# Altium schematic sheet PenAndPaper.SchDoc
size A
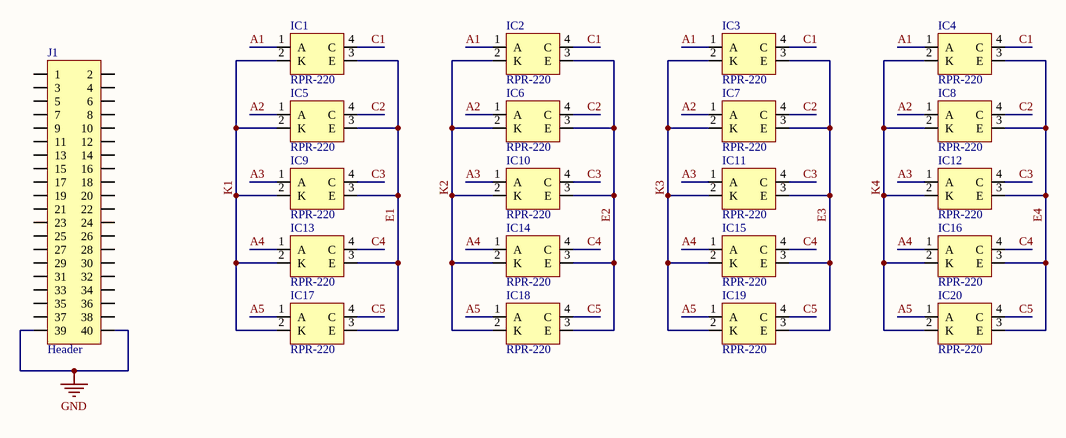
[diagram p0: PenAndPaper.SchDoc]

## Parts
IC1  RPR-220  [RPR_220]
IC2  RPR-220  [RPR_220]
IC3  RPR-220  [RPR_220]
IC4  RPR-220  [RPR_220]
IC5  RPR-220  [RPR_220]
IC6  RPR-220  [RPR_220]
IC7  RPR-220  [RPR_220]
IC8  RPR-220  [RPR_220]
IC9  RPR-220  [RPR_220]
IC10  RPR-220  [RPR_220]
IC11  RPR-220  [RPR_220]
IC12  RPR-220  [RPR_220]
IC13  RPR-220  [RPR_220]
IC14  RPR-220  [RPR_220]
IC15  RPR-220  [RPR_220]
IC16  RPR-220  [RPR_220]
IC17  RPR-220  [RPR_220]
IC18  RPR-220  [RPR_220]
IC19  RPR-220  [RPR_220]
IC20  RPR-220  [RPR_220]
J1  Header  [PINHD_2.54_2X40]

## Nets
GND: J1.39 J1.40
A1: IC1.1(A) IC2.1(A) IC3.1(A) IC4.1(A)
A2: IC5.1(A) IC6.1(A) IC7.1(A) IC8.1(A)
A3: IC9.1(A) IC10.1(A) IC11.1(A) IC12.1(A)
A4: IC13.1(A) IC14.1(A) IC15.1(A) IC16.1(A)
A5: IC17.1(A) IC18.1(A) IC19.1(A) IC20.1(A)
C1: IC1.4(C) IC2.4(C) IC3.4(C) IC4.4(C)
C2: IC5.4(C) IC6.4(C) IC7.4(C) IC8.4(C)
C3: IC9.4(C) IC10.4(C) IC11.4(C) IC12.4(C)
C4: IC13.4(C) IC14.4(C) IC15.4(C) IC16.4(C)
C5: IC17.4(C) IC18.4(C) IC19.4(C) IC20.4(C)
E1: IC1.3(E) IC5.3(E) IC9.3(E) IC13.3(E) IC17.3(E)
E2: IC2.3(E) IC6.3(E) IC10.3(E) IC14.3(E) IC18.3(E)
E3: IC3.3(E) IC7.3(E) IC11.3(E) IC15.3(E) IC19.3(E)
E4: IC4.3(E) IC8.3(E) IC12.3(E) IC16.3(E) IC20.3(E)
K1: IC1.2(K) IC5.2(K) IC9.2(K) IC13.2(K) IC17.2(K)
K2: IC2.2(K) IC6.2(K) IC10.2(K) IC14.2(K) IC18.2(K)
K3: IC3.2(K) IC7.2(K) IC11.2(K) IC15.2(K) IC19.2(K)
K4: IC4.2(K) IC8.2(K) IC12.2(K) IC16.2(K) IC20.2(K)

Not connected (* = marked no-connect by the designer): J1 1 2 3 4 5 6 7 8 9 10 11 12 13 14 15 16 17 18 19 20 21 22 23 24 25 26 27 28 29 30 31 32 33 34 35 36 37 38

## Library data of the parts
IC1-IC20 = RPR-220: Infrared Reflex Photosensor
J1 = PINHD_2x40: Pin Header 2x40P